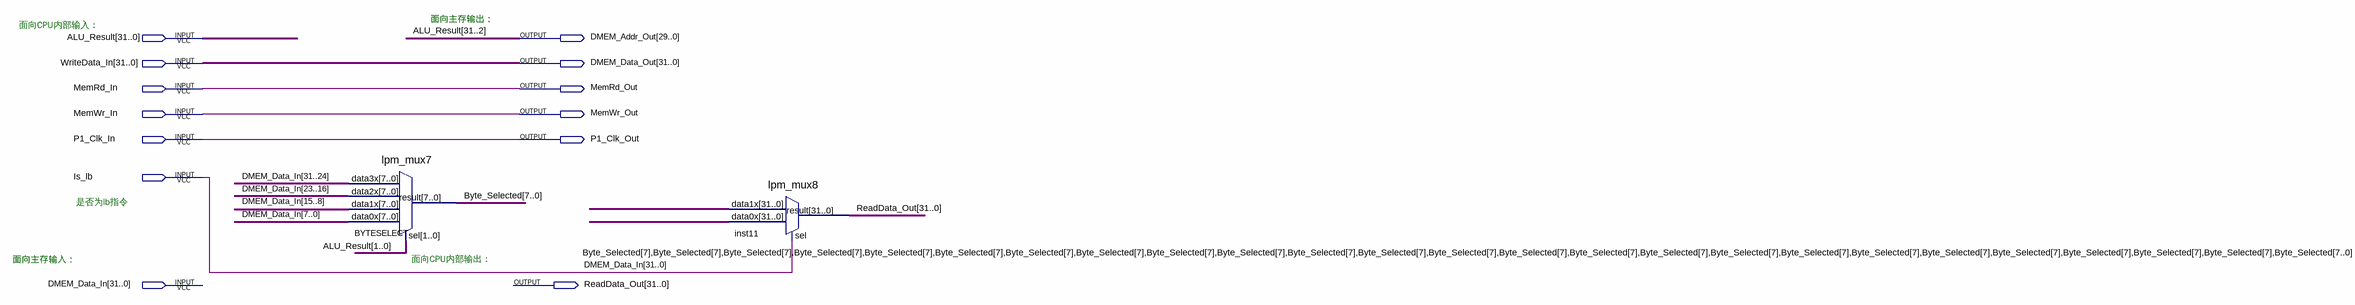
[diagram p0: schematic sheet]
// Quartus schematic DBIU.bdf as structural Verilog: 2 symbols, 13 pins
module DBIU (
  input  [31:0] ALU_Result,
  input  [31:0] WriteData_In,
  input  MemRd_In,
  input  MemWr_In,
  input  P1_Clk_In,
  input  Is_lb,
  input  [31:0] DMEM_Data_In,
  output [29:0] DMEM_Addr_Out,
  output [31:0] DMEM_Data_Out,
  output MemRd_Out,
  output MemWr_Out,
  output P1_Clk_Out,
  output [31:0] ReadData_Out
);

  wire [7:0] Byte_Selected;

  lpm_mux7 BYTESELECT (
    .data3x(DMEM_Data_In[31:24]), .data2x(DMEM_Data_In[23:16]), .data1x(DMEM_Data_In[15:8]),
    .data0x(DMEM_Data_In[7:0]), .sel(ALU_Result[1:0]), .result(Byte_Selected));
  lpm_mux8 inst11 (
    .data1x({{25{Byte_Selected[7]}}, Byte_Selected[6:0]}), .data0x(DMEM_Data_In), .sel(Is_lb),
    .result(ReadData_Out));

  assign DMEM_Addr_Out = ALU_Result[31:2];
  assign DMEM_Data_Out = WriteData_In;
  assign MemRd_Out = MemRd_In;
  assign MemWr_Out = MemWr_In;
  assign P1_Clk_Out = P1_Clk_In;

  // Notes on the sheet:
  //   面向主存输出：
  //   面向CPU内部输入：
  //   是否为lb指令
  //   面向主存输入：
  //   面向CPU内部输出：
endmodule
